# Altium schematic sheet Photodiode TIA_real_comp.SchDoc
size A4; SheetNumber: 1; SheetTotal: 1; SPICEModelCacheDTMIEZZV: <root> / <DocumentId>DTMIEZZV</DocumentId> / </root>
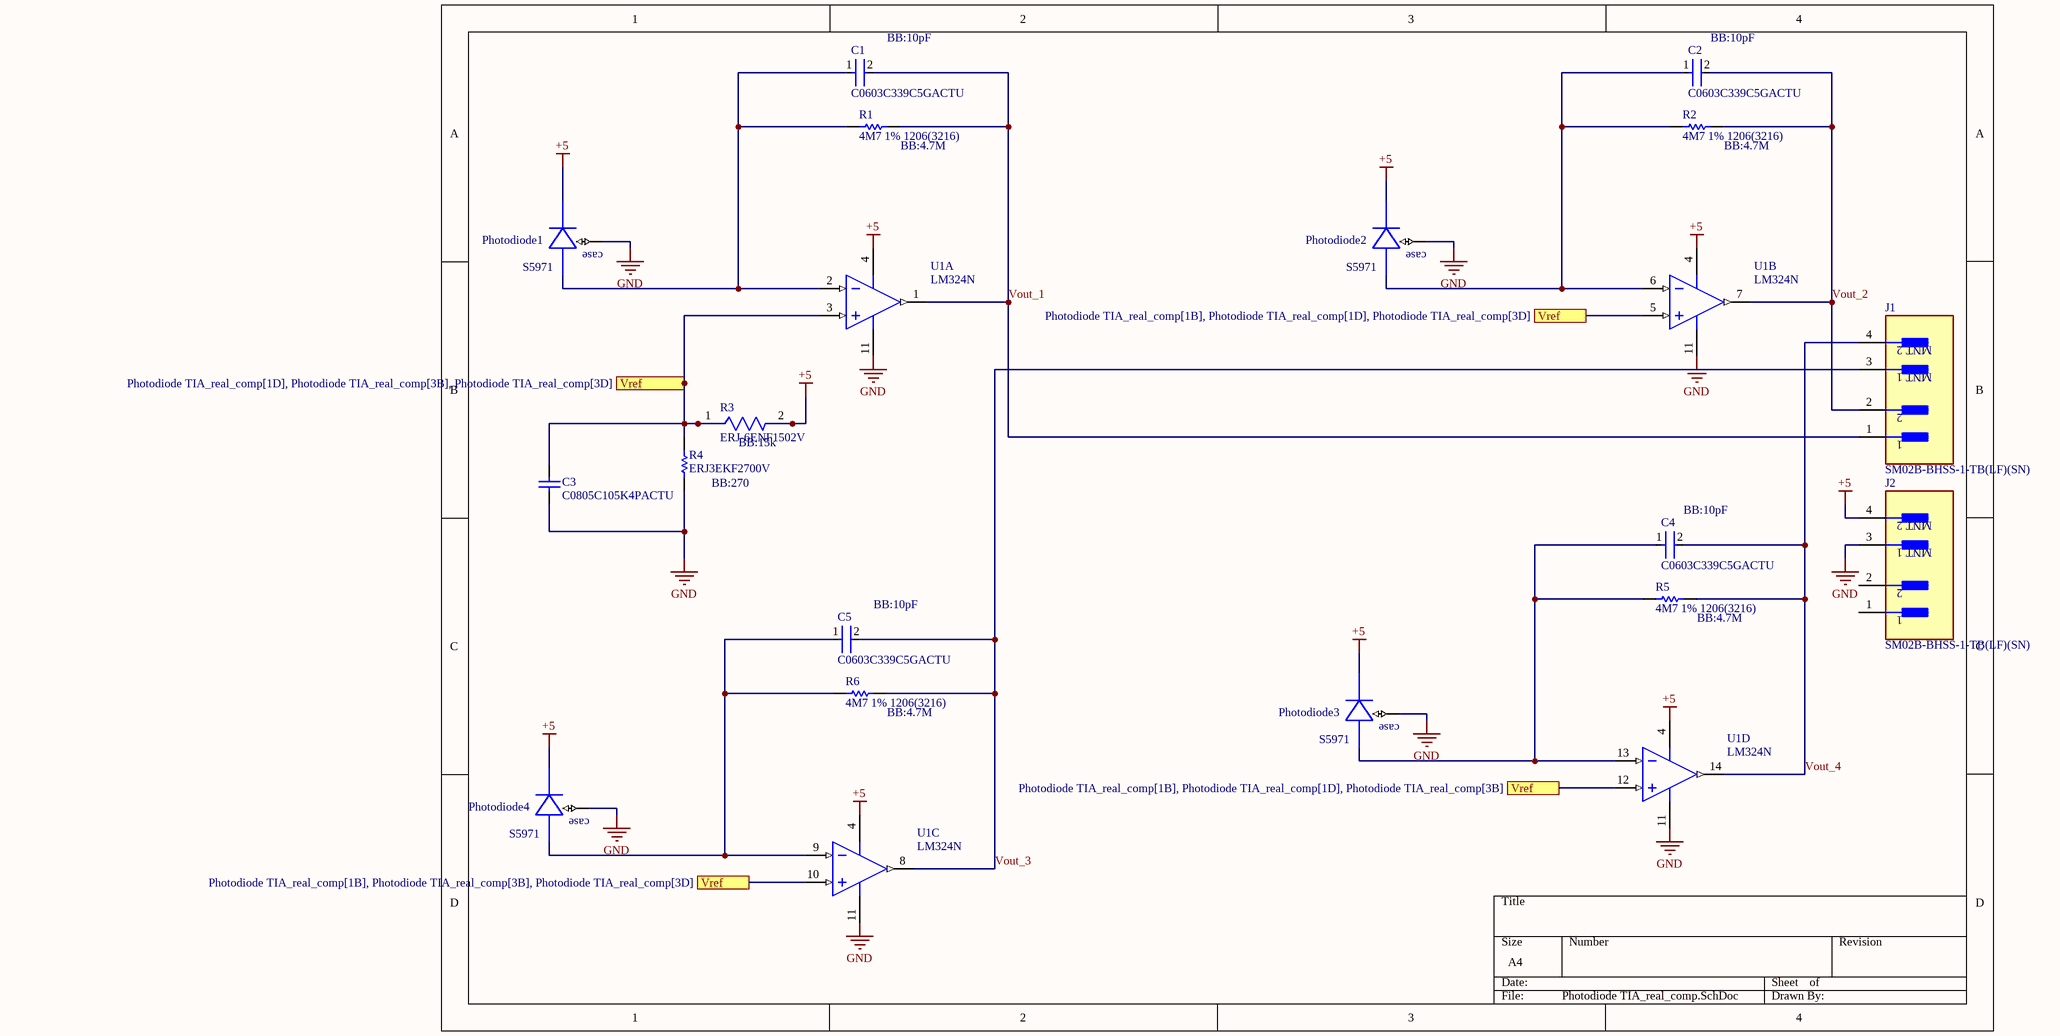
[diagram p0: Photodiode TIA_real_comp.SchDoc]

## Parts
C1  C0603C339C5GACTU  [FP-C0603C-CF-MFG]
C2  C0603C339C5GACTU  [FP-C0603C-CF-MFG]
C3  C0805C105K4PACTU  [CAPC2013X145X50LL20T25]
C4  C0603C339C5GACTU  [FP-C0603C-CF-MFG]
C5  C0603C339C5GACTU  [FP-C0603C-CF-MFG]
J1  SM02B-BHSS-1-TB(LF)(SN)  [FP-SM02B-BHSS-1-TB_LF_SN-MFG]
J2  SM02B-BHSS-1-TB(LF)(SN)  [FP-SM02B-BHSS-1-TB_LF_SN-MFG]
Photodiode1  S5971  [S5971-CASE]
Photodiode2  S5971  [S5971-CASE]
Photodiode3  S5971  [S5971-CASE]
Photodiode4  S5971  [S5971-CASE]
R1  4M7 1% 1206(3216)  [RESC1206(3216)_N]
R2  4M7 1% 1206(3216)  [RESC1206(3216)_N]
R3  ERJ-6ENF1502V  [FP-ERJ6EN-IPC_C]
R4  ERJ3EKF2700V  [RESC1608X55X30LL15T15]
R5  4M7 1% 1206(3216)  [RESC1206(3216)_N]
R6  4M7 1% 1206(3216)  [RESC1206(3216)_N]
U1  LM324N  [N0014A]  (parts A,B,C,D of 4)

## Ports
Vref (see Photodiode TIA_real_comp[1B], Photodiode TIA_real_comp[1D], Photodiode TIA_real_comp[3B]), Vref (see Photodiode TIA_real_comp[1B], Photodiode TIA_real_comp[1D], Photodiode TIA_real_comp[3D]), Vref (see Photodiode TIA_real_comp[1B], Photodiode TIA_real_comp[3B], Photodiode TIA_real_comp[3D]), Vref (see Photodiode TIA_real_comp[1D], Photodiode TIA_real_comp[3B], Photodiode TIA_real_comp[3D])

## Nets
+5: J2.4(MNT_2) Photodiode1.P$1(CATHODE) Photodiode2.P$1(CATHODE) Photodiode3.P$1(CATHODE) Photodiode4.P$1(CATHODE) R3.2 U1.4(V+)
GND: C3.2 J2.3(MNT_1) Photodiode1.P$2(CASE) Photodiode2.P$2(CASE) Photodiode3.P$2(CASE) Photodiode4.P$2(CASE) R4.1 U1.11(GND)
Vout_1: C1.2 J1.1 R1.2 U1.1(OUT1)
Vout_2: C2.2 J1.2 R2.2 U1.7(OUT2)
Vout_3: C5.2 J1.3(MNT_1) R6.2 U1.8(OUT3)
Vout_4: C4.2 J1.4(MNT_2) R5.2 U1.14(OUT4)
Vref: C3.1 R3.1 R4.2 U1.3(IN1+) U1.5(IN2+) U1.10(IN3+) U1.12(IN4+) ; port Vref
NetC1_1: C1.1 Photodiode1.P$3(ANODE) R1.1 U1.2(IN1-)
NetC2_1: C2.1 Photodiode2.P$3(ANODE) R2.1 U1.6(IN2-)
NetC4_1: C4.1 Photodiode3.P$3(ANODE) R5.1 U1.13(IN4-)
NetC5_1: C5.1 Photodiode4.P$3(ANODE) R6.1 U1.9(IN3-)

Not connected (* = marked no-connect by the designer): J2 1 2

## Notes on the sheet
- (near C1) BB:10pF
- (near C2) BB:10pF
- (near R1) BB:4.7M
- (near R2) BB:4.7M
- (near R3) BB:15k
- (near R4) BB:270
- (near C4) BB:10pF
- (near C5) BB:10pF
- (near R5) BB:4.7M
- (near R6) BB:4.7M
- (in symbol S5971) case

## Library data of the parts
C1 C2 C4 C5 = CMP-1035-00238-3: CAP CER 3.3PF 50V NP0 0603; Manufacturer: KEMET; Tolerance: 0.25 pF; Material: Ceramic; Temperature Characteristic: C0G; Automotive Grade: Grade 1; Description: C0603 3.3 pF C0G 30ppm/°C 0.25 pF 50 V; Temperature Coefficient: 30ppm/°C; Height: 0.87mm; Category: Cap; Automotive: Yes; Voltage Rating: 50 V; Capacitance: 3.3 pF; ComponentLink2Description: Datasheet; Octopart: https://octopart.com/c0603c339c5gactu-kemet-3701205; Temperature Range Low: -55°C; Device Class L3: Ceramic Capacitors; Manufacturer Part Number: C0603C339C5GACTU; Package: C0603C-CF; Temperature: -55°C to +125°C; Digikey Description: CAP CER 3.3PF 50V NP0 0603; Temperature Range High: +125°C; ComponentLink2URL: https://api.kemet.com/component-edge/download/datasheet/C0603C100J5GACAUTO.pdf; Device Class L1: Passive Components; Value: 3.3 pF; RoHS: TRUE; Lead Free: Yes; Mouser Description: Multilayer Ceramic Capacitors MLCC - SMD/SMT 50volts 3.3pF C0G 0.25%; Device Class L2: Capacitors
C3 = CMP-1036-04746-2: Manufacturer: Kemet; Part Number: C0805C105K4PACTU
J1 J2 = CMP-17439-000011-1: CONN HEADER SMD R/A 2POS 3.5MM; Manufacturer: JST; Conn Orientation: Right Angle; Number Of Contacts: 2; Voltage Rating: 1400V; Current Rating: 1A; Conn Gender: Male; Octopart: https://octopart.com/sm02b-bhss-1-tb%28lf%29%28sn%29-jst-655226; Lead Free: Yes; Height: 3.2mm; ComponentLink2Description: Datasheet; RoHS: TRUE; Package: SM02B-BHSS-1-TB(LF)(SN); Temperature Range Low: -25°C; Temperature Range High: +85°C; Contact Material: Tin,Copper; ComponentLink2URL: http://www.jst-mfg.com/product/pdf/eng/eBHS1.pdf; Number Of Rows: 1; Temperature: -25°C to +85°C; Device Class L3: unset; Device Class L1: Connectors; Manufacturer Part Number: SM02B-BHSS-1-TB(LF)(SN); Pitch: 3.5mm; Device Class L2: Headers and Wire Housings; Automotive: No; Category: Conn; Digikey Description: CONN HEADER SMD R/A 2POS 3.5MM
Photodiode1-Photodiode4 = S5971: Heat Shrink Tubing, Semi Rigid 0.250 _6.35mm_ 2 to 1 White; MF: TE Connectivity; Price: None; Value: *; TE_purchase_URL: https://www.te.com/usa-en/product-S5971.html?te_bu=Cor&te_type=disp&te_campaign=seda_glo_cor-seda-global-disp-prtnr-fy19-seda-model-bom-cta_sma-317_1&elqCampaignId=32493; Availability: Unavailable; SnapEDA_Link: https://www.snapeda.com/parts/S5971/TE%20Connectivity%20Raychem%20Cable%20Protection/view-part/378018/?ref=snap; MP: S5971; Package: TO-18 Hamamatsu
R1 R2 R5 R6 = CMP-1014-00925-1: 4M7 0.25W 1% 1206 (3216 Metric)  SMD; Case-Metric: 3216; Case-EIA: 1206; Value: 4700000.00 Ohm; Tolerance: 1 %; Technology: SMT; Power: 0.25 W
R3 = CMP-2001-04439-3: RES SMD 15K OHM 1% 1/8W 0805; Max Power Dissipation: 125mW; Voltage Rating (DC): 150V; Temperature Coefficient: 100ppm/°C; Resistance: 15kR; Construction: Rectangular; RoHS Compliant: Yes; Mount: Surface Mount; Military Standard: Not; Depth: 1.25mm; Resistance Tolerance: 1%; Termination: SMD/SMT; Reach SVHC Compliant: Yes; Package Quantity: 1; Voltage Rating: 150V; Power Rating: 125mW; Resistor Type: Thick Film; Features: Automotive AEC-Q200; Case/Package: 0805; Radiation Hardening: No; Number of Terminations: 2; Case Code (Metric): 2012; Tolerance: 1%; Packaging: Tape and Reel; Number of Pins: 2; Technology: THICK FILM; Size Code: 0805; Max Operating Temperature: 155°C; Min Operating Temperature: -55°C; Height: 0.6mm; Lead Free: Lead Free; Series: ERJ; Case Code (Imperial): 0805; Contact Plating: Tin; Width: 1.2mm; Length: 2mm
R4 = CMP-2000-00388-1: Manufacturer: Panasonic; Part Number: ERJ3EKF2700V
U1 = CMP-0055-00082-3: Low Power Quad Operational Amplifier, 14-pin MDIP; Manufacturer: Texas Instruments; CompType: Amplifiers; PowerWise: N; PackageTopMarking: NSUZXYYTTE#*LM324N; PackageDescription: MDIP, .750 x .250 x.130in, 14 Lead, .100in Pitch; Package Reference: N0014A; RoHS: N; Code_JEDEC: MS-001-AA; ComponentLink1URL: http://www.ti.com/general/docs/lit/getliterature.tsp?genericPartNumber=LM324&fileType=pdf; ComponentLink1Description: Datasheet URL; PinCount: 14